# Altium project lamp.PrjPCB
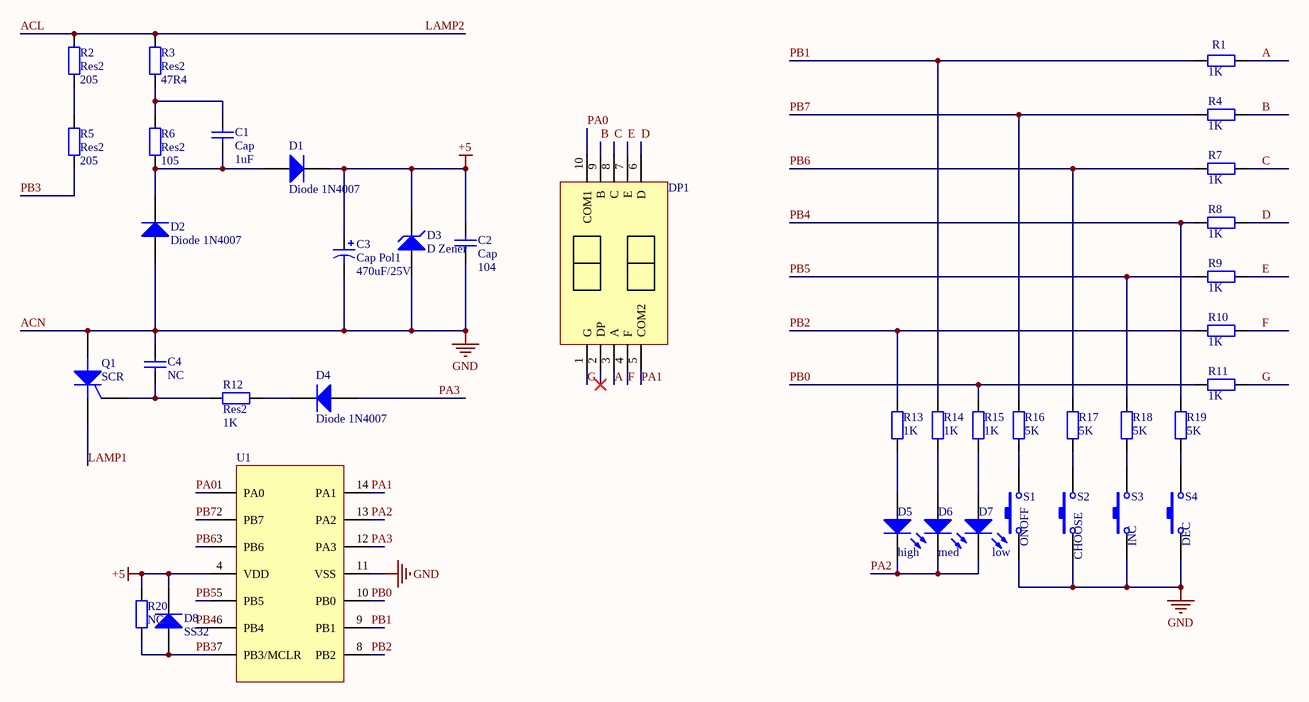
[diagram p0: Sheet1.SchDoc]
1 sheet, 39 parts. Net scope: global (net labels, ports and power ports of the same name join across sheets).

## Sheet Sheet1.SchDoc
size A4; PageSetup: Record=PageOptions|CenterHorizontal=True|CenterVertical=True|PrintScale=0.96|XCorrection=1.00|YCorrection=1.00|PrintKind=0|BorderSize=5000000|LeftOffset=0|BottomOffset=0|Orientation=2|PaperLength=1000|PaperWidth=1000|Scale=100|PaperSource=7|PrintQuality=-4|MediaType=1|DitherType=10|PaperKind=A4|PrintScaleMode=1

### Parts
C1  Cap  value 1uF  [RAD-0.3]
C2  Cap  value 104  [RAD-0.3]
C3  Cap Pol1  value 470uF/25V  [RB7.6-15]
C4  NC  [RAD-0.3]
D1  Diode 1N4007  [DO-41]
D2  Diode 1N4007  [DO-41]
D3  D Zener  [DIODE-0.7]
D4  Diode 1N4007  [DO-41]
D5  high  [LED-0]
D6  med  [LED-0]
D7  low  [LED-0]
D8  SS32  [DO-41]
DP1  (no value)
Q1  SCR  [TO-220-AB]
R1  value 1K  [AXIAL-0.4]  (hidden comment: Res2)
R2  Res2  value 205  [AXIAL-0.4]
R3  Res2  value 47R4  [AXIAL-0.4]
R4  value 1K  [AXIAL-0.4]  (hidden comment: Res2)
R5  Res2  value 205  [AXIAL-0.4]
R6  Res2  value 105  [AXIAL-0.4]
R7  value 1K  [AXIAL-0.4]  (hidden comment: Res2)
R8  value 1K  [AXIAL-0.4]  (hidden comment: Res2)
R9  value 1K  [AXIAL-0.4]  (hidden comment: Res2)
R10  value 1K  [AXIAL-0.4]  (hidden comment: Res2)
R11  value 1K  [AXIAL-0.4]  (hidden comment: Res2)
R12  Res2  value 1K  [AXIAL-0.4]
R13  value 1K  [AXIAL-0.4]  (hidden comment: Res2)
R14  value 1K  [AXIAL-0.4]  (hidden comment: Res2)
R15  value 1K  [AXIAL-0.4]  (hidden comment: Res2)
R16  value 5K  [AXIAL-0.4]  (hidden comment: Res2)
R17  value 5K  [AXIAL-0.4]  (hidden comment: Res2)
R18  value 5K  [AXIAL-0.4]  (hidden comment: Res2)
R19  value 5K  [AXIAL-0.4]  (hidden comment: Res2)
R20  value NC  [AXIAL-0.4]  (hidden comment: Res2)
S1  ONOFF  [SPST-2]
S2  CHOOSE  [SPST-2]
S3  INC  [SPST-2]
S4  DEC  [SPST-2]
U1  SQ013-SOP14  (value not drawn)

### Nets
+5: C2.2 C3.1 D1.2(K) D3.2(K) D8.2(K) R20.2 U1.4(VDD)
ACN: C2.1 C3.2 C4.2 D2.1(A) D3.1(A) Q1.1(A) S1.1 S2.1 S3.1 S4.1 U1.11(VSS)  [also labelled GND]
A: DP1.3(A) R1.2
ACL: R2.2 R3.2  [also labelled LAMP2]
B: DP1.9(B) R4.2
C: DP1.8(C) R7.2
D: DP1.6(D) R8.2
E: DP1.7(E) R9.2
F: DP1.4(F) R10.2
G: DP1.1(G) R11.2
LAMP1: Q1.3(K)
PA0: DP1.10(COM1) U1.1(PA0)
PA1: DP1.5(COM2) U1.14(PA1)
PA2: D5.2(K) D6.2(K) D7.2(K) U1.13(PA2)
PA3: D4.1(A) U1.12(PA3)
PB0: R11.1 R15.2 U1.10(PB0)
PB1: R1.1 R14.2 U1.9(PB1)
PB2: R10.1 R13.2 U1.8(PB2)
PB3: D8.1(A) R5.1 R20.1 U1.7(PB3/MCLR)
PB4: R8.1 R19.2 U1.6(PB4)
PB5: R9.1 R18.2 U1.5(PB5)
PB6: R7.1 R17.2 U1.3(PB6)
PB7: R4.1 R16.2 U1.2(PB7)
NetC1_1: C1.1 D1.1(A) D2.2(K) R6.1
NetC1_2: C1.2 R3.1 R6.2
NetC4_1: C4.1 Q1.2(G) R12.2
NetD4_2: D4.2(K) R12.1
NetD5_1: D5.1(A) R13.1
NetD6_1: D6.1(A) R14.1
NetD7_1: D7.1(A) R15.1
NetR2_1: R2.1 R5.2
NetR16_1: R16.1 S1.2
NetR17_1: R17.1 S2.2
NetR18_1: R18.1 S3.2
NetR19_1: R19.1 S4.2

Not connected (* = marked no-connect by the designer): DP1 2(DP)*

### Library data of the parts
C1 C2 = Cap: Capacitor; Published: 8-Jun-2000; LatestRevisionDate: 17-Jul-2002; LatestRevisionNote: Re-released for DXP Platform.; PackageReference: RAD-0.3; Publisher: Altium Limited; PackageDescription: Radial Cap, Thru-Hole; 2 Leads; 0.3 in Pin Spacing
C3 = Cap Pol1: Polarized Capacitor (Radial); Published: 8-Jun-2000; LatestRevisionDate: 17-Jul-2002; LatestRevisionNote: Re-released for DXP Platform.; PackageReference: RB7.6-15; Publisher: Altium Limited; PackageDescription: Polarized Capacitor (Radial); 2 Leads
C4 = Cap: Capacitor; Value: 100pF; Published: 8-Jun-2000; LatestRevisionDate: 17-Jul-2002; LatestRevisionNote: Re-released for DXP Platform.; PackageReference: RAD-0.3; Publisher: Altium Limited; PackageDescription: Radial Cap, Thru-Hole; 2 Leads; 0.3 in Pin Spacing
D1 D2 D4 D8 = Diode 1N4007: 1 Amp General Purpose Rectifier; Published: 8-Jun-2000; LatestRevisionDate: 17-Jul-2002; LatestRevisionNote: Re-released for DXP Platform.; DatasheetVersion: 1998; PackageVersion: Aug-1999; PackageReference: DO-41; Publisher: Altium Limited; PackageDescription: Diode, Axial; Body 5.2 x 2.7 mm (LxDia. max), Lead Dia. 0.86 mm (max); Code_JEDEC: DO-204-AL; ComponentLink1Description: Manufacturer Link; ComponentLink1URL: http://www.fairchildsemi.com/; ComponentLink2Description: Datasheet; ComponentLink2URL: http://www.fairchildsemi.com/ds/1N%2F1N4001.pdf
D3 = D Zener: Zener Diode; Published: 8-Jun-2000; LatestRevisionDate: 17-Jul-2002; LatestRevisionNote: Re-released for DXP Platform.; PackageReference: DIODE-0.7; Publisher: Altium Limited; PackageDescription: Diode, Thru-Hole; 2 Leads; 0.7 in Pin Spacing
D5-D7 = LED0: Typical INFRARED GaAs LED; Published: 8-Jun-2000; LatestRevisionDate: 08-Jul-2005; LatestRevisionNote: Mech Layer 1 removed.; PackageReference: LED-0; Publisher: Altium Limited; PackageDescription: LED; 2 Leads
DP1 = gongyinshumaguan*2
Q1 = SCR: Silicon Controlled Rectifier; Published: 8-Jun-2000; LatestRevisionDate: 17-Jul-2002; LatestRevisionNote: Re-released for DXP Platform.; PackageReference: TO-220-AB; Publisher: Altium Limited; Code_JEDEC: TO-220-AB
R1-R20 = Res2: Resistor; Published: 8-Jun-2000; LatestRevisionDate: 17-Jul-2002; LatestRevisionNote: Re-released for DXP Platform.; PackageReference: AXIAL-0.4; Publisher: Altium Limited; PackageDescription: Axial Device, Thru-Hole; 2 Leads; 0.4 in Pin Spacing
S1-S4 = SW-PB: Switch; Published: 24-Mar-1999; LatestRevisionDate: 17-Jul-2002; LatestRevisionNote: Re-released for DXP Platform.; PackageReference: SPST-2; Publisher: Altium Limited; PackageDescription: Switch; 2 Leads